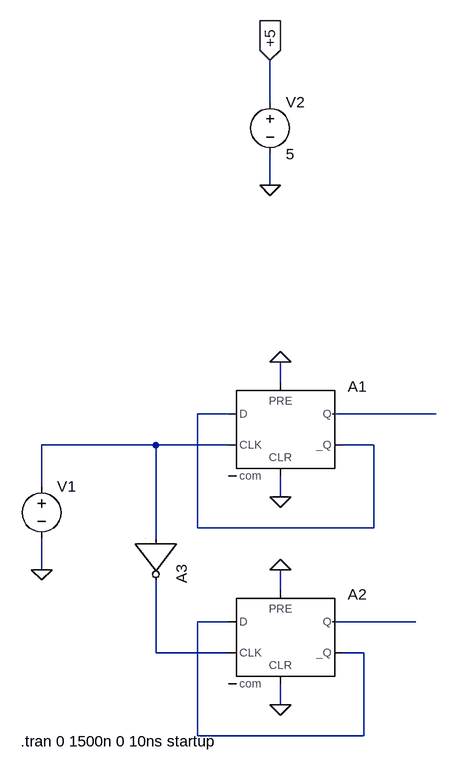
[diagram p0: schematic I-Q D-Flipflop.asc]
I-Q D-Flipflop.asc, the LTspice schematic file:
Version 4
SHEET 1 1140 680
WIRE 192 -432 192 -496
WIRE 192 -304 192 -352
WIRE 208 0 208 -32
WIRE 128 48 80 48
WIRE 448 48 288 48
WIRE 16 96 -160 96
WIRE 128 96 16 96
WIRE 352 96 304 96
WIRE -160 160 -160 96
WIRE 208 176 208 144
WIRE 80 224 80 48
WIRE 352 224 352 96
WIRE 352 224 80 224
WIRE 16 240 16 96
WIRE -160 288 -160 240
WIRE 208 320 208 288
WIRE 128 368 80 368
WIRE 416 368 288 368
WIRE 16 416 16 304
WIRE 128 416 16 416
WIRE 336 416 304 416
WIRE 208 496 208 464
WIRE 80 544 80 368
WIRE 336 544 336 416
WIRE 336 544 80 544
FLAG 208 496 0
FLAG 208 176 0
FLAG 208 288 0
FLAG 208 -32 0
FLAG -160 288 0
FLAG 192 -304 0
FLAG 192 -496 +5
IOPIN 192 -496 In
SYMBOL Digital\\dflop 208 0 R0
WINDOW 3 8 12 Invisible 2
SYMATTR Value Vhigh=5V Vlow=0V
SYMATTR InstName A1
SYMATTR SpiceLine Trise=0.5n Tfall=0.5n td=1n
SYMBOL Digital\\dflop 208 320 R0
WINDOW 3 8 12 Invisible 2
SYMATTR Value Vhigh=5V Vlow=0V
SYMATTR InstName A2
SYMATTR SpiceLine Trise=0.5n Tfall=0.5n td=1n
SYMBOL Digital\\inv 80 240 R90
WINDOW 3 8 104 Invisible 2
SYMATTR InstName A3
SYMATTR Value Vhigh=5V Vlow=0V
SYMBOL voltage -160 144 R0
WINDOW 3 24 96 Invisible 2
WINDOW 123 0 0 Left 0
WINDOW 39 0 0 Left 0
SYMATTR Value PULSE(0 5 0 5ps 5ps 5ns 10ns)
SYMATTR InstName V1
SYMBOL voltage 192 -448 R0
WINDOW 123 0 0 Left 0
WINDOW 39 0 0 Left 0
SYMATTR InstName V2
SYMATTR Value 5
TEXT -192 552 Left 2 !.tran 0 1500n 0 10ns startup

The netlist it stands for:
* I-Q D-Flipflop.asc
A1 N001 0 N003 0 0 N001 N002 0 DFLOP Vhigh=5V Vlow=0V Trise=0.5n Tfall=0.5n td=1n
A2 N004 0 N006 0 0 N004 N005 0 DFLOP Vhigh=5V Vlow=0V Trise=0.5n Tfall=0.5n td=1n
A3 N003 0 0 0 0 N006 0 0 BUF Vhigh=5V Vlow=0V
V1 N003 0 PULSE(0 5 0 5ps 5ps 5ns 10ns)
V2 +5 0 5
.tran 0 1500n 0 10ns startup
.backanno
.end